# EasyEDA Pro project 轮腿PCB.eprj, board PCB3
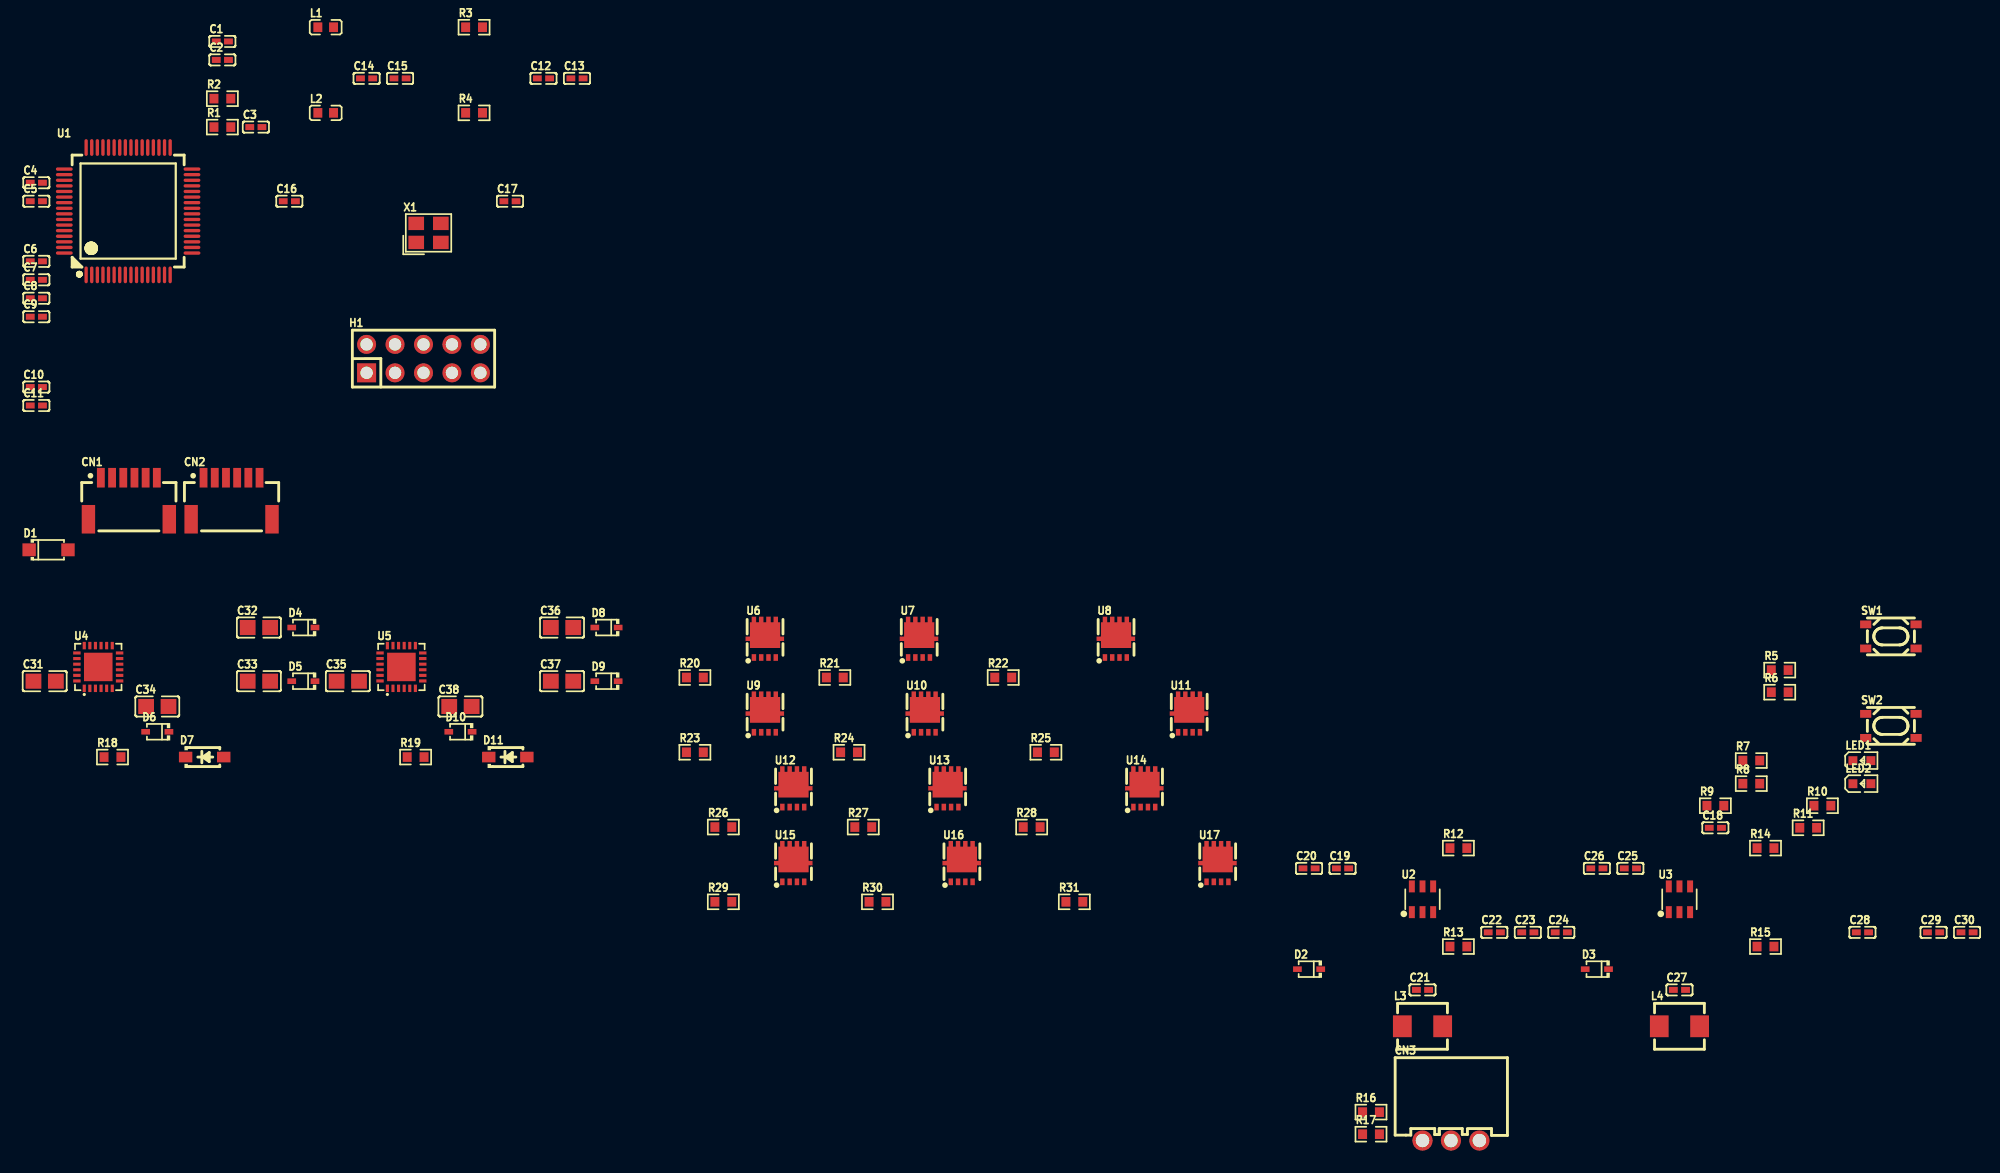
[diagram p10: board, top side]
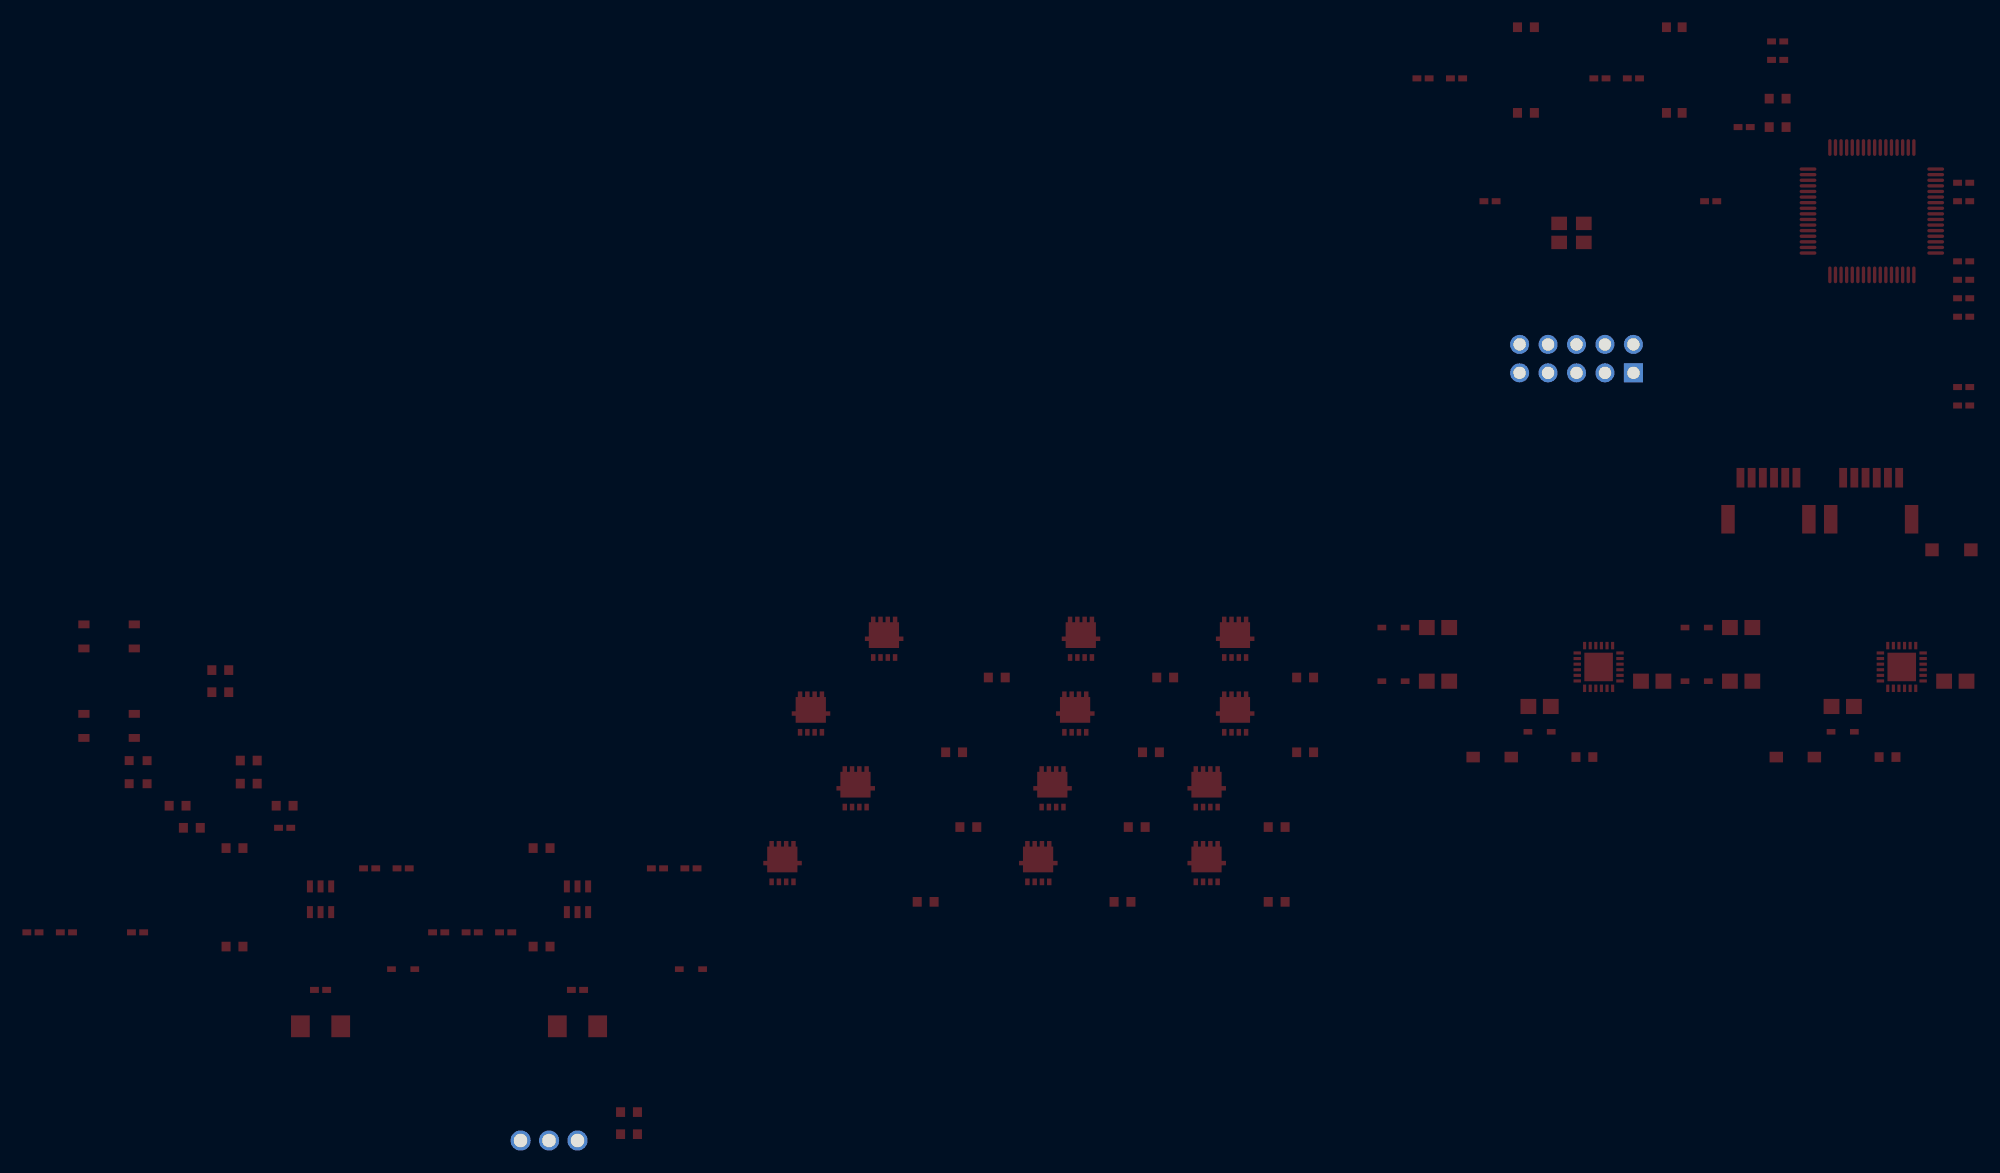
[diagram p11: board, bottom side, seen from below]

No outline. copper layers: Top Layer, Bottom Layer. Coordinates in mm from the lowest, leftmost part position.
Stack: Top Layer 0.035mm / Dielectric1 1.51mm FR4 er 4.5 / Bottom Layer 0.035mm

## Design rules (mm)
template: JLCPCB Capability(Two Layers Board)
spacing copperThickness1oz (default): track to track 0.102, other pairs 0.152 to 0.3
spacing copperThickness2oz: track to track 0.203, other pairs 0.152 to 0.3
track width copperThickness1oz (default): min 0.127, default 0.254, max 2.54
track width copperThickness2oz: min 0.203, default 0.254, max 2.54
differential pair differentialPair (default): width min 0.127, default 0.254, max 2.54; gap min 0.152, default 0.152
via viaSize (default): diameter min 0.5, default 0.61, max 10; hole min 0.3, default 0.305, max 6.3

## Placement (name value [footprint] x y rotation side)
C1  4.7uF  [C0402]  16.61 98.18 0 top
C2  100nF  [C0402]  16.61 96.53 0 top
C3  100nF  [C0402]  19.6 90.53 0 top
C4  4.7uF  [C0402]  0 85.56 0 top
C5  100nF  [C0402]  0 83.91 0 top
C6  4.7uF  [C0402]  0 78.54 0 top
C7  100nF  [C0402]  0 76.89 0 top
C8  4.7uF  [C0402]  0 75.24 0 top
C9  100nF  [C0402]  0 73.59 0 top
C10  4.7uF  [C0402]  0 67.31 0 top
C11  100nF  [C0402]  0 65.66 0 top
C12  2.2uF  [C0402]  45.27 94.88 0 top
C13  100nF  [C0402]  48.26 94.88 0 top
C14  4.7uF  [C0402]  29.48 94.88 0 top
C15  100nF  [C0402]  32.47 94.88 0 top
C16  10pF  [C0402]  22.59 83.91 0 top
C17  10pF  [C0402]  42.28 83.91 0 top
C18  100nF  [C0402]  149.89 27.94 0 top
C19  100nF  [C0402]  116.61 24.31 0 top
C20  22uF  [C0402]  113.62 24.31 0 top
C21  100nF  [C0402]  123.75 13.46 0 top
C22  220pF  [C0402]  130.16 18.6 0 top
C23  22uF  [C0402]  133.15 18.6 0 top
C24  100nF  [C0402]  136.14 18.6 0 top
C25  100nF  [C0402]  142.31 24.31 0 top
C26  22uF  [C0402]  139.32 24.31 0 top
C27  100nF  [C0402]  146.69 13.46 0 top
C28  220pF  [C0402]  163.03 18.6 0 top
C29  22uF  [C0402]  169.38 18.6 0 top
C30  100nF  [C0402]  172.37 18.6 0 top
C31  22uF  [C0805]  0.74 41.03 0 top
C32  4.7uF  [C0805]  19.87 45.83 0 top
C33  4.7uF  [C0805]  19.87 41.03 0 top
C34  4.7uF  [C0805]  10.8 38.77 0 top
C35  22uF  [C0805]  27.81 41.03 0 top
C36  4.7uF  [C0805]  46.93 45.83 0 top
C37  4.7uF  [C0805]  46.93 41.03 0 top
C38  4.7uF  [C0805]  37.86 38.77 0 top
CN1  HC-1.0-6PWT  [CONN-SMD_HCTL_HC-1.0-6PWT]  8.26 57.35 0 top
CN2  HC-1.0-6PWT  [CONN-SMD_HCTL_HC-1.0-6PWT]  17.43 57.35 0 top
CN3  XH-3AW  [CONN-TH_3P-P2.54_HCTL_XH-3AW]  126.29 0 0 top
D1  SMF3.3A  [SOD-123FL_L2.7-W1.8-LS3.7-RD]  1.09 52.77 0 top
D2  B5819WS  [SOD-323_L1.7-W1.3-LS2.5-FD]  113.62 15.31 0 top
D3  B5819WS  [SOD-323_L1.7-W1.3-LS2.5-FD]  139.32 15.31 0 top
D4  B5819WS  [SOD-323_L1.7-W1.3-LS2.5-FD]  23.84 45.83 0 top
D5  B5819WS  [SOD-323_L1.7-W1.3-LS2.5-FD]  23.84 41.03 0 top
D6  B5819WS  [SOD-323_L1.7-W1.3-LS2.5-FD]  10.8 36.51 0 top
D7  BZT52C15Q-7-F  [SOD-123_L2.7-W1.6-LS3.7-RD-1]  15.03 34.25 0 top
D8  B5819WS  [SOD-323_L1.7-W1.3-LS2.5-FD]  50.9 45.83 0 top
D9  B5819WS  [SOD-323_L1.7-W1.3-LS2.5-FD]  50.9 41.03 0 top
D10  B5819WS  [SOD-323_L1.7-W1.3-LS2.5-FD]  37.86 36.51 0 top
D11  BZT52C15Q-7-F  [SOD-123_L2.7-W1.6-LS3.7-RD-1]  42.09 34.25 0 top
H1  -  [HDR-TH_10P-P2.54-V-M-R2-C5-S2.54]  34.56 69.85 0 top
L1  BLM18PG121SN1D  [L0603]  25.83 99.45 0 top
L2  BLM18PG121SN1D  [L0603]  25.83 91.8 0 top
L3  4.7uH  [IND-SMD_L4.5-W4.2]  123.75 10.2 0 top
L4  4.7uH  [IND-SMD_L4.5-W4.2]  146.69 10.2 0 top
LED1  -  [LED_0603]  163.03 33.94 0 top
LED2  -  [LED_0603]  163.03 31.88 0 top
R1  100R  [R0603]  16.61 90.53 0 top
R2  10K  [R0603]  16.61 93.07 0 top
R3  0R  [R0603]  39.08 99.45 0 top
R4  0R  [R0603]  39.08 91.8 0 top
R5  4.7K  [R0603]  155.64 42.02 0 top
R6  100R  [R0603]  155.64 40.05 0 top
R7  1K  [R0603]  153.1 33.94 0 top
R8  1K  [R0603]  153.1 31.88 0 top
R9  1K  [R0603]  149.89 29.91 0 top
R10  10K  [R0603]  159.45 29.91 0 top
R11  100R  [R0603]  158.18 27.94 0 top
R12  10K  [R0603]  126.96 26.12 0 top
R13  73.2K  [R0603]  126.96 17.33 0 top
R14  10K  [R0603]  154.37 26.12 0 top
R15  45.3K  [R0603]  154.37 17.33 0 top
R16  100R  [R0603]  119.15 2.54 0 top
R17  100R  [R0603]  119.15 0.57 0 top
R18  100R  [R0603]  6.8 34.25 0 top
R19  100R  [R0603]  33.86 34.25 0 top
R20  4.7R  [R0603]  58.79 41.36 0 top
R21  4.7R  [R0603]  71.28 41.36 0 top
R22  4.7R  [R0603]  86.32 41.36 0 top
R23  4.7R  [R0603]  58.79 34.68 0 top
R24  4.7R  [R0603]  72.55 34.68 0 top
R25  4.7R  [R0603]  90.13 34.68 0 top
R26  4.7R  [R0603]  61.33 28 0 top
R27  4.7R  [R0603]  73.82 28 0 top
R28  4.7R  [R0603]  88.86 28 0 top
R29  4.7R  [R0603]  61.33 21.32 0 top
R30  4.7R  [R0603]  75.09 21.32 0 top
R31  4.7R  [R0603]  92.67 21.32 0 top
SW1  TS3425BA  [SW-SMD_4P-L4.2-W3.2-P2.15-LS4.6-1]  165.57 45.03 0 top
SW2  TS3425BA  [SW-SMD_4P-L4.2-W3.2-P2.15-LS4.6-1]  165.57 37.04 0 top
U1  CYT2BL3CAAQ0AZEGS  [LQFP-64_L10.0-W10.0-P0.50-LS12.0-BL]  8.19 83.02 0 top
U2  RY9121E  [SOT-23-6_L2.9-W1.6-P0.95-LS2.8-BL]  123.75 21.55 0 top
U3  RY9121E  [SOT-23-6_L2.9-W1.6-P0.95-LS2.8-BL]  146.69 21.55 0 top
U4  FD6288Q  [QFN-24_L4.0-W4.0-P0.50-BL-EP2.6]  5.53 42.3 0 top
U5  FD6288Q  [QFN-24_L4.0-W4.0-P0.50-BL-EP2.6]  32.59 42.3 0 top
U6  TPN2R703NL,L1Q(M  [TSON-8_L3.1-W3.1-P0.65-LS3.3-BL-EP]  65.04 44.82 0 top
U7  TPN2R703NL,L1Q(M  [TSON-8_L3.1-W3.1-P0.65-LS3.3-BL-EP]  78.8 44.82 0 top
U8  TPN2R703NL,L1Q(M  [TSON-8_L3.1-W3.1-P0.65-LS3.3-BL-EP]  96.37 44.82 0 top
U9  TPN2R703NL,L1Q(M  [TSON-8_L3.1-W3.1-P0.65-LS3.3-BL-EP]  65.04 38.14 0 top
U10  TPN2R703NL,L1Q(M  [TSON-8_L3.1-W3.1-P0.65-LS3.3-BL-EP]  79.31 38.14 0 top
U11  TPN2R703NL,L1Q(M  [TSON-8_L3.1-W3.1-P0.65-LS3.3-BL-EP]  102.9 38.14 0 top
U12  TPN2R703NL,L1Q(M  [TSON-8_L3.1-W3.1-P0.65-LS3.3-BL-EP]  67.58 31.46 0 top
U13  TPN2R703NL,L1Q(M  [TSON-8_L3.1-W3.1-P0.65-LS3.3-BL-EP]  81.34 31.46 0 top
U14  TPN2R703NL,L1Q(M  [TSON-8_L3.1-W3.1-P0.65-LS3.3-BL-EP]  98.91 31.46 0 top
U15  TPN2R703NL,L1Q(M  [TSON-8_L3.1-W3.1-P0.65-LS3.3-BL-EP]  67.58 24.78 0 top
U16  TPN2R703NL,L1Q(M  [TSON-8_L3.1-W3.1-P0.65-LS3.3-BL-EP]  82.61 24.78 0 top
U17  TPN2R703NL,L1Q(M  [TSON-8_L3.1-W3.1-P0.65-LS3.3-BL-EP]  105.44 24.78 0 top
X1  16MHz  [CRYSTAL-SMD_4P-L3.2-W2.5-BL]  35.01 81.08 0 top

## Footprints (pads in the part's own frame, mm; a bottom-side part is the same pattern mirrored in y, then rotated)
C0402
  rect 0.79x0.54 smd: 1(-0.545,0) 2(0.545,0)
C0805
  rect 1.41x1.35 smd: 1(-1,0) 2(1,0)
CONN-SMD_HCTL_HC-1.0-6PWT
  rect 0.7x1.75 smd: 1(-2.5,1.855) 2(-1.5,1.855) 3(-0.5,1.855) 4(0.5,1.855) 5(1.5,1.855) 6(2.5,1.855)
  rect 1.2x2.55 smd: 7(3.61,-1.855) 8(-3.61,-1.855)
CONN-TH_3P-P2.54_HCTL_XH-3AW
  round 1.8 hole 1.199: 1(-2.54,0) 2(0.002,0) 3(2.54,0)
CRYSTAL-SMD_4P-L3.2-W2.5-BL
  rect 1.4x1.2 smd: 1(-1.1,-0.85) 2(1.1,-0.85) 3(1.1,0.85) 4(-1.1,0.85)
HDR-TH_10P-P2.54-V-M-R2-C5-S2.54
  rect 1.7x1.7 hole 1.1: 1(-5.08,-1.27)
  round 1.7 hole 1.1: 2(-5.08,1.27) 3(-2.54,-1.27) 4(-2.54,1.27) 5(0,-1.27) 6(0,1.27) 7(2.54,-1.27) 8(2.54,1.27) 9(5.08,-1.27) 10(5.08,1.27)
IND-SMD_L4.5-W4.2
  rect 1.675x1.95 smd: 1(-1.8,0) 2(1.8,0)
L0603
  rect 0.8x0.864 smd: 1(-0.7,0) 2(0.7,0)
LED_0603
  rect 0.8x0.8 smd: 1(-0.851,-0.01) 2(0.75,-0.005)
LQFP-64_L10.0-W10.0-P0.50-LS12.0-BL
  oval 0.3x1.5 smd: 1(-3.75,-5.688) 2(-3.25,-5.688) 3(-2.75,-5.688) 4(-2.25,-5.688) 5(-1.75,-5.688) 6(-1.25,-5.688) 7(-0.75,-5.688) 8(-0.25,-5.688) 9(0.25,-5.688) 10(0.75,-5.688) 11(1.25,-5.688) 12(1.75,-5.688) 13(2.25,-5.688) 14(2.75,-5.688) 15(3.25,-5.688) 16(3.75,-5.688) 33(3.75,5.688) 34(3.25,5.688) 35(2.75,5.688) 36(2.25,5.688) 37(1.75,5.688) 38(1.25,5.688) 39(0.75,5.688) 40(0.25,5.688) 41(-0.25,5.688) 42(-0.75,5.688) 43(-1.25,5.688) 44(-1.75,5.688) 45(-2.25,5.688) 46(-2.75,5.688) 47(-3.25,5.688) 48(-3.75,5.688)
  oval 1.5x0.3 smd: 17(5.7,-3.738) 18(5.7,-3.238) 19(5.7,-2.738) 20(5.7,-2.238) 21(5.7,-1.738) 22(5.7,-1.238) 23(5.7,-0.739) 24(5.7,-0.238) 25(5.7,0.262) 26(5.7,0.762) 27(5.7,1.262) 28(5.7,1.762) 29(5.7,2.261) 30(5.7,2.762) 31(5.7,3.261) 32(5.7,3.762) 49(-5.7,3.762) 50(-5.7,3.261) 51(-5.7,2.762) 52(-5.7,2.261) 53(-5.7,1.762) 54(-5.7,1.262) 55(-5.7,0.762) 56(-5.7,0.262) 57(-5.7,-0.238) 58(-5.7,-0.739) 59(-5.7,-1.238) 60(-5.7,-1.738) 61(-5.7,-2.238) 62(-5.7,-2.738) 63(-5.7,-3.238) 64(-5.7,-3.738)
QFN-24_L4.0-W4.0-P0.50-BL-EP2.6
  rect 0.28x0.665 smd: 1(-1.25,-1.907) 2(-0.75,-1.907) 3(-0.25,-1.907) 4(0.25,-1.907) 5(0.75,-1.907) 6(1.25,-1.907) 13(1.25,1.907) 14(0.75,1.907) 15(0.25,1.907) 16(-0.25,1.907) 17(-0.75,1.907) 18(-1.25,1.907)
  rect 0.665x0.28 smd: 7(1.907,-1.25) 8(1.907,-0.75) 9(1.907,-0.25) 10(1.907,0.25) 11(1.907,0.75) 12(1.907,1.25) 19(-1.907,1.25) 20(-1.907,0.75) 21(-1.907,0.25) 22(-1.907,-0.25) 23(-1.907,-0.75) 24(-1.907,-1.25)
  rect 2.55x2.55 smd: 25(0,0)
R0603
  rect 0.806x0.864 smd: 1(-0.753,0) 2(0.753,0)
SOD-123_L2.7-W1.6-LS3.7-RD-1
  rect 1.2x0.95 smd: 1(-1.7,0) 2(1.7,0)
SOD-123FL_L2.7-W1.8-LS3.7-RD
  rect 1.2x1.15 smd: 1(-1.735,0) 2(1.735,0)
SOD-323_L1.7-W1.3-LS2.5-FD
  rect 0.78x0.5 smd: 1(-1.04,0) 2(1.04,0)
SOT-23-6_L2.9-W1.6-P0.95-LS2.8-BL
  rect 0.532x1.072 smd: 1(-0.95,-1.149) 2(0,-1.149) 3(0.95,-1.149) 4(0.95,1.149) 5(0,1.149) 6(-0.95,1.149)
SW-SMD_4P-L4.2-W3.2-P2.15-LS4.6-1
  rect 1x0.7 smd: 1(-2.25,1.075) 2(2.25,1.075) 3(-2.25,-1.075) 4(2.25,-1.075)
TSON-8_L3.1-W3.1-P0.65-LS3.3-BL-EP
  rect 0.4x0.6 smd: 1(-0.975,-1.675) 2(-0.325,-1.675) 3(0.325,-1.675) 4(0.975,-1.675) 5(0.975,1.675) 6(0.325,1.675) 7(-0.325,1.675) 8(-0.975,1.675)
  rect 0.6x0.4 smd: 9(-1.42,0) 9(1.42,0)
  rect 2.7x2.3 smd: 9(0.02,0.325)

## Nets
As in the schematic.

Pads without a net: CN1 7 8; CN2 7 8; H1 6 8; SW1 2 3; SW2 2 3; U1 13 21 22 23 24 25 30 31 40 41 42 43 50 51 59 60 61 64; U4 5 7 8 21; U5 5 7 8 21; U6 2 3 5 6 7 8; U7 2 3 5 6 7 8; U8 2 3 5 6 7 8; U9 2 3 6 7 8 9; U10 2 3 6 7 8 9; U11 2 3 6 7 8 9; U12 2 3 5 6 7 8; U13 2 3 5 6 7 8; U14 2 3 5 6 7 8; U15 2 3 6 7 8 9; U16 2 3 6 7 8 9; U17 2 3 6 7 8 9
